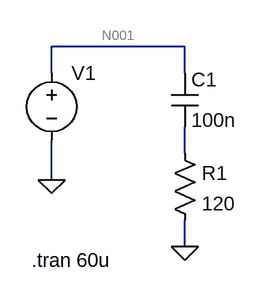
[diagram p0: schematic v1.0.asc]
v1.0.asc, the LTspice schematic file:
Version 4.1
SHEET 1 880 680
WIRE 352 48 192 48
WIRE 192 80 192 48
WIRE 352 80 352 48
WIRE 352 176 352 144
WIRE 192 208 192 160
WIRE 352 288 352 256
FLAG 192 208 0
FLAG 352 288 0
SYMBOL voltage 192 64 R0
WINDOW 123 0 0 Left 0
WINDOW 39 0 0 Left 0
WINDOW 3 24 96 Invisible 2
SYMATTR InstName V1
SYMATTR Value SINE(0 310 50 -5m)
SYMBOL cap 336 80 R0
SYMATTR InstName C1
SYMATTR Value 100n
SYMBOL res 336 160 R0
SYMATTR InstName R1
SYMATTR Value 120
TEXT 168 304 Left 2 !.tran 60u

The netlist it stands for:
* v1.0.asc
V1 N001 0 SINE(0 310 50 -5m)
C1 N001 N002 100n
R1 N002 0 120
.tran 60u
.backanno
.end

* Results of the author's LTspice run, read from the files saved beside the schematic
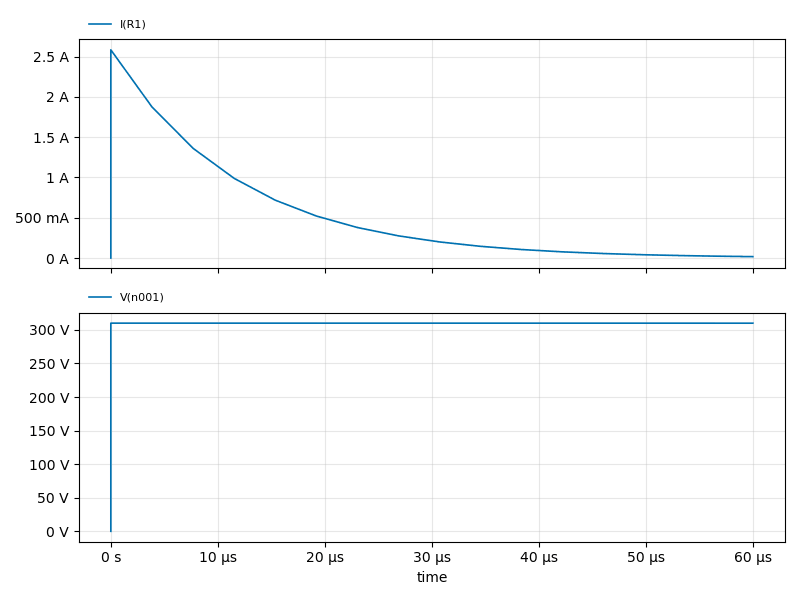
[diagram p1: Transient Analysis of v1.0.asc, plotted from the saved traces]
* Transient Analysis, 1 run:
*   I(R1): min 0 A, max 2.583 A, average 517.5 mA, rms 830.6 mA, last 17.26 mA
*   V(n001): min 0 V, max 310 V, average 310 V, rms 310 V, last 309.9 V